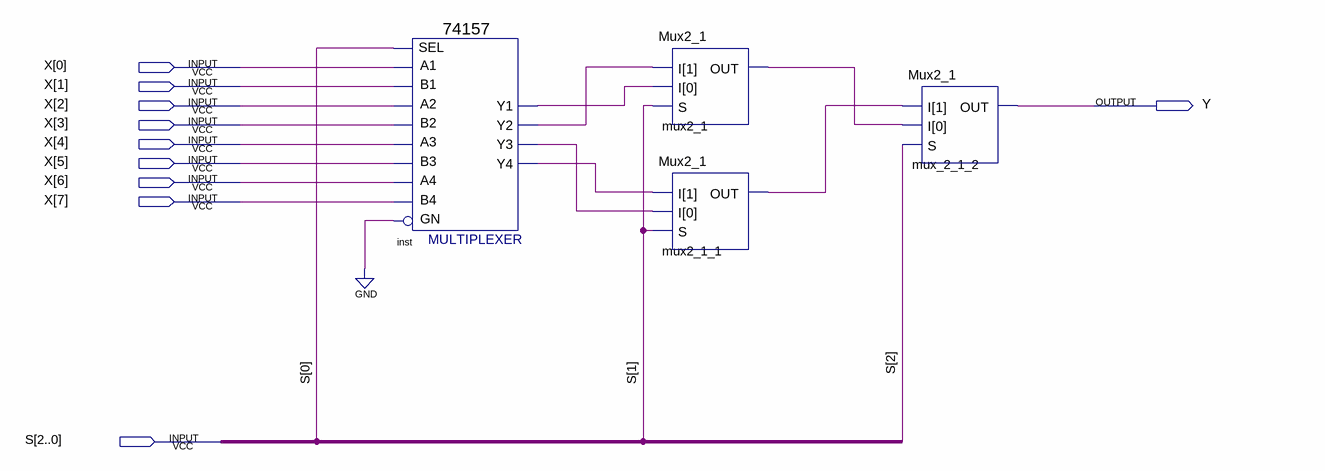
[diagram p0: schematic sheet]
// Quartus schematic Mux8_1.bdf as structural Verilog: 4 symbols, 10 pins
module Mux8_1 (
  input  [7:0] X,
  input  [2:0] S,
  output Y
);

  wire inst_y1, inst_y2, inst_y3, inst_y4, mux2_1_1_out, mux2_1_out;

  \74157  inst (
    .A1(X[0]), .B1(X[1]), .SEL(S[0]), .B2(X[3]), .A3(X[4]), .B3(X[5]), .A2(X[2]), .B4(X[7]), .GN(1'b0),
    .A4(X[6]), .Y2(inst_y2), .Y1(inst_y1), .Y4(inst_y4), .Y3(inst_y3));
  Mux2_1 mux2_1 (.I({inst_y2, inst_y1}), .S(S[1]), .OUT(mux2_1_out));
  Mux2_1 mux2_1_1 (.I({inst_y4, inst_y3}), .S(S[1]), .OUT(mux2_1_1_out));
  Mux2_1 mux_2_1_2 (.I({mux2_1_1_out, mux2_1_out}), .S(S[2]), .OUT(Y));
endmodule
